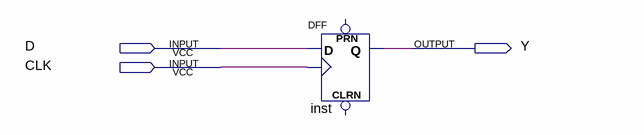
[diagram p0: schematic sheet]
// Quartus schematic dflip.bdf as structural Verilog: 1 symbols, 3 pins
module dflip (
  input  D,
  input  CLK,
  output Y
);

  DFF inst (.CLK(CLK), .D(D), .Q(Y));  // open: CLRN, PRN
endmodule
